# EAGLE design proto (EAGLE 6.4)
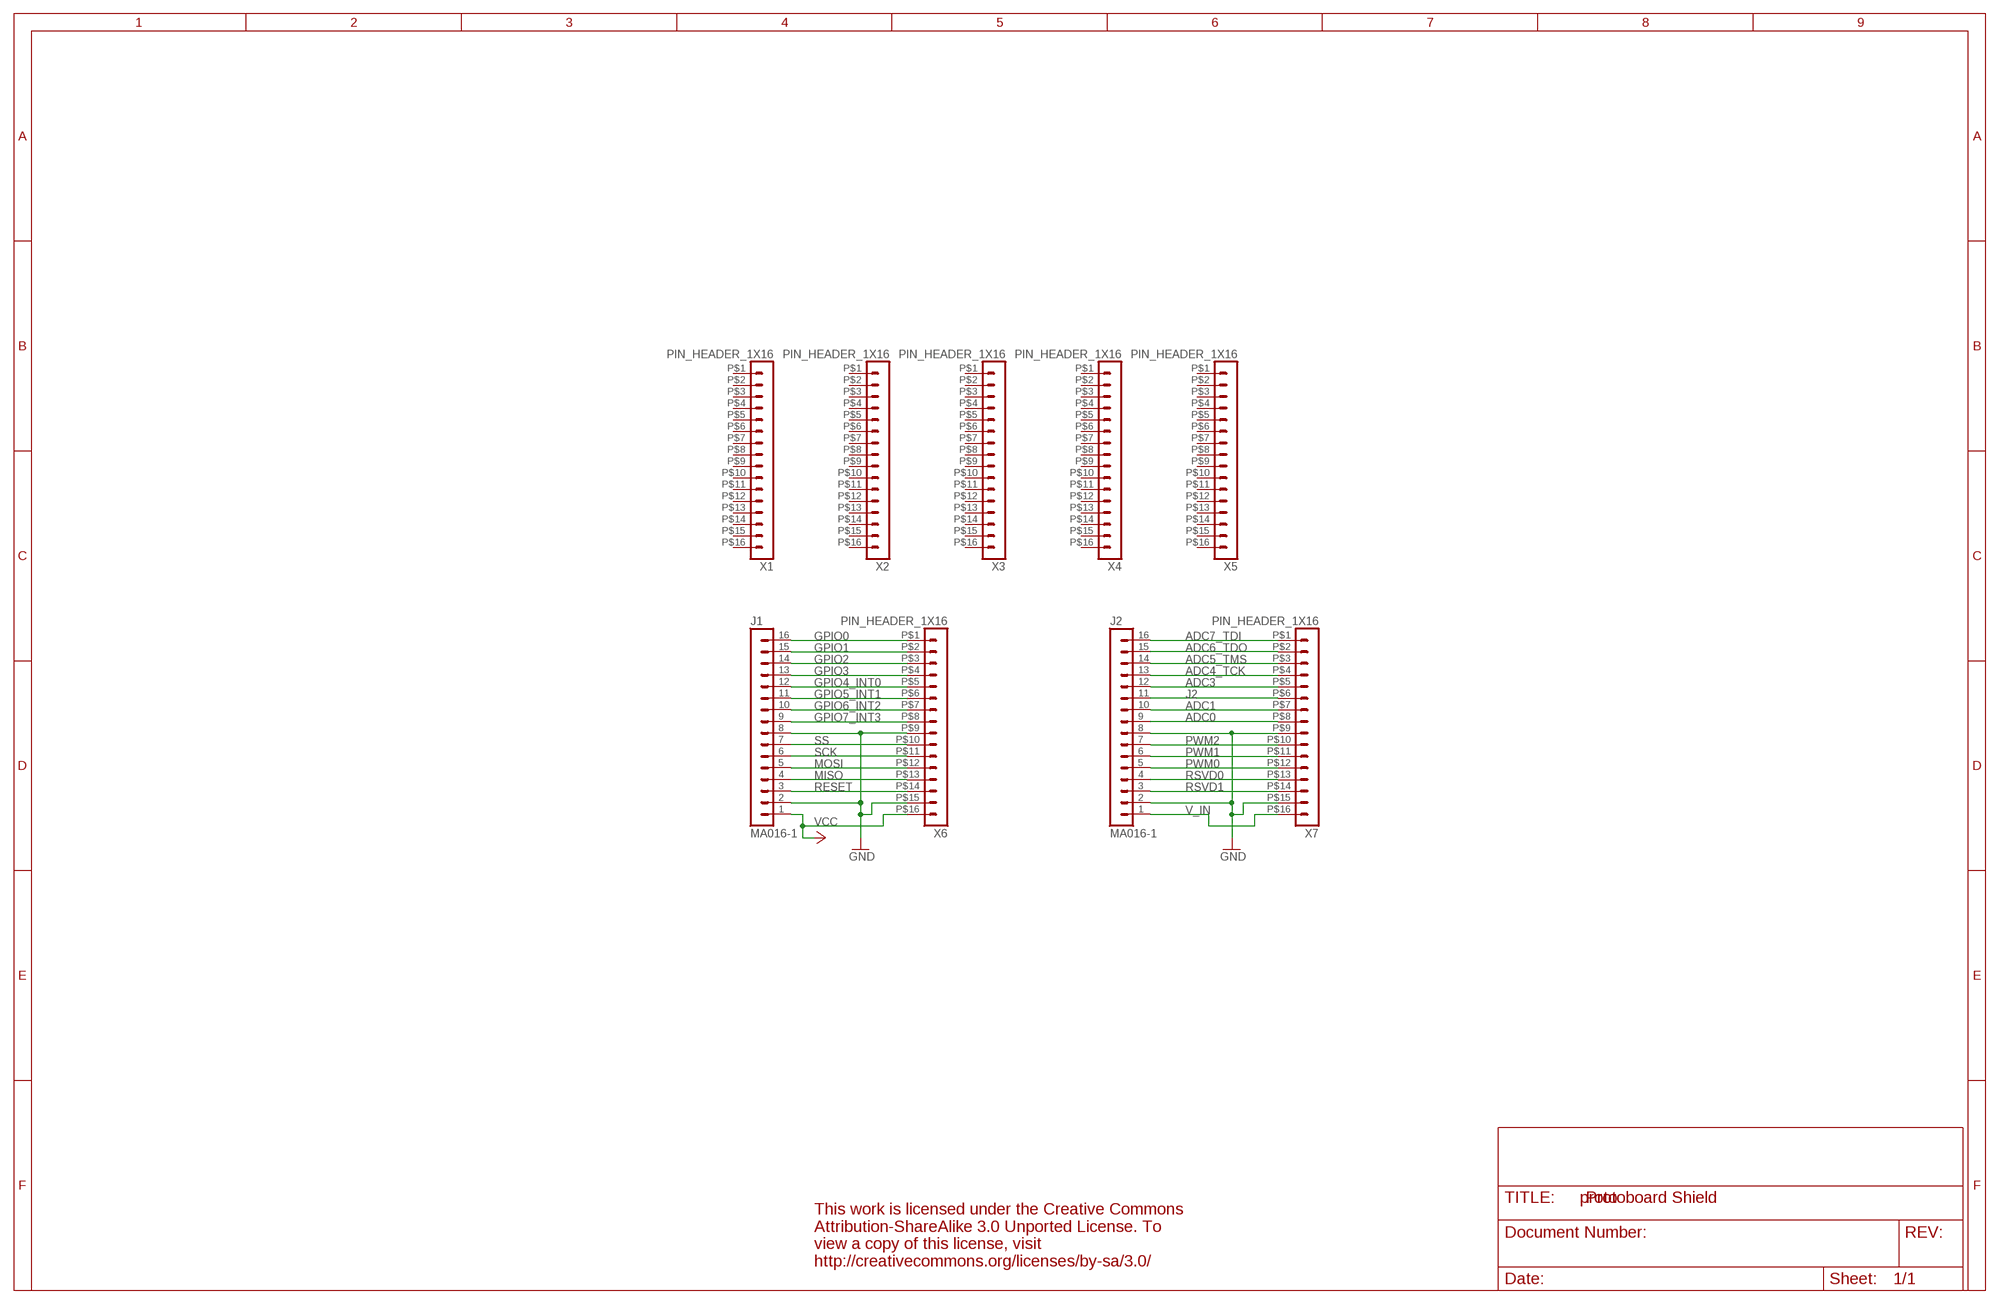
[diagram p0: schematic, sheet 1]

## Parts
J1  MA016-1  [MA016-1]
J2  MA016-1  [MA016-1]
X1  PIN_HEADER_1X16  [PIN_HEADER_1X16]
X2  PIN_HEADER_1X16  [PIN_HEADER_1X16]
X3  PIN_HEADER_1X16  [PIN_HEADER_1X16]
X4  PIN_HEADER_1X16  [PIN_HEADER_1X16]
X5  PIN_HEADER_1X16  [PIN_HEADER_1X16]
X6  PIN_HEADER_1X16  [PIN_HEADER_1X16]
X7  PIN_HEADER_1X16  [PIN_HEADER_1X16]

## Nets
ADC0: J2.9 X7.P$8
ADC1: J2.10 X7.P$7
ADC3: J2.12 X7.P$5
ADC4_TCK: J2.13 X7.P$4
ADC5_TMS: J2.14 X7.P$3
ADC6_TDO: J2.15 X7.P$2
ADC7_TDI: J2.16 X7.P$1
GND: J1.2 J1.8 J2.2 J2.8 X6.P$9 X6.P$15 X7.P$9 X7.P$15
GPIO0: J1.16 X6.P$1
GPIO1: J1.15 X6.P$2
GPIO2: J1.14 X6.P$3
GPIO3: J1.13 X6.P$4
GPIO4_INT0: J1.12 X6.P$5
GPIO5_INT1: J1.11 X6.P$6
GPIO6_INT2: J1.10 X6.P$7
GPIO7_INT3: J1.9 X6.P$8
J2: J2.11 X7.P$6
MISO: J1.4 X6.P$13
MOSI: J1.5 X6.P$12
PWM0: J2.5 X7.P$12
PWM1: J2.6 X7.P$11
PWM2: J2.7 X7.P$10
RESET: J1.3 X6.P$14
RSVD0: J2.4 X7.P$13
RSVD1: J2.3 X7.P$14
SCK: J1.6 X6.P$11
SS: J1.7 X6.P$10
V_IN: J2.1 X7.P$16
VCC: J1.1 X6.P$16
Unconnected: X1.P$1 X1.P$2 X1.P$3 X1.P$4 X1.P$5 X1.P$6 X1.P$7 X1.P$8 X1.P$9 X1.P$10 X1.P$11 X1.P$12 X1.P$13 X1.P$14 X1.P$15 X1.P$16 X2.P$1 X2.P$2 X2.P$3 X2.P$4 X2.P$5 X2.P$6 X2.P$7 X2.P$8 X2.P$9 X2.P$10 X2.P$11 X2.P$12 X2.P$13 X2.P$14 X2.P$15 X2.P$16 X3.P$1 X3.P$2 X3.P$3 X3.P$4 X3.P$5 X3.P$6 X3.P$7 X3.P$8 X3.P$9 X3.P$10 X3.P$11 X3.P$12 X3.P$13 X3.P$14 X3.P$15 X3.P$16 X4.P$1 X4.P$2 X4.P$3 X4.P$4 X4.P$5 X4.P$6 X4.P$7 X4.P$8 X4.P$9 X4.P$10 X4.P$11 X4.P$12 X4.P$13 X4.P$14 X4.P$15 X4.P$16 X5.P$1 X5.P$2 X5.P$3 X5.P$4 X5.P$5 X5.P$6 X5.P$7 X5.P$8 X5.P$9 X5.P$10 X5.P$11 X5.P$12 X5.P$13 X5.P$14 X5.P$15 X5.P$16

## Notes on the sheet
- Protoboard Shield

## Library data of the parts
J1 J2 = jeremy:MA016-1
X1-X7 = sapphire:PIN_HEADER_1X16

## Board
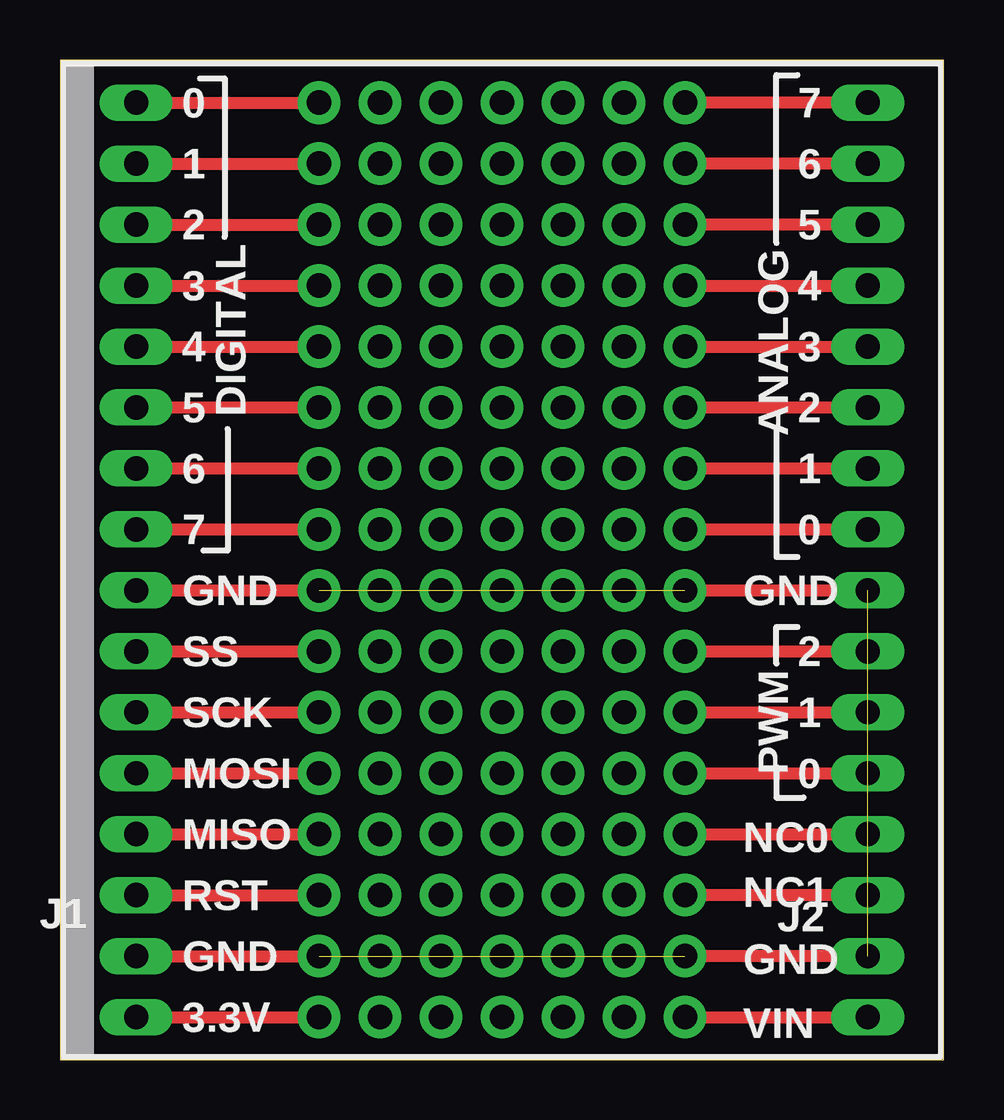
[diagram p1: board, top side]

Size 36.83 x 41.66 mm. Coordinates in mm from the lower left corner, seen from the top.
Outline: 0,0 36.83,0 36.83,41.66 0,41.66 0,0
Copper layers (1*16): Top 0.035mm / dielectric 1.5mm / Bottom 0.035mm
Design rules "default": minimum track width 10mil, minimum drill 20mil, track to track 8mil, track to pad 8mil, pad to pad 6mil, via to via 8mil, smd to smd 8mil, copper to edge 20mil, drill to drill 8mil, minimum pad ring 10mil, minimum via ring 8mil, stop-mask expansion 4mil, vias tented up to drill 0mil, thermal gap 10mil

### Footprints (pad centres in the part's own frame; a part is rotated, then mirrored left to right if it is on the bottom)
MA016-1 = drill 1.016 long: 1 -19.05,0; 2 -16.51,0; 3 -13.97,0; 4 -11.43,0; 5 -8.89,0; 6 -6.35,0; 7 -3.81,0; 8 -1.27,0; 9 1.27,0; 10 3.81,0; 11 6.35,0; 12 8.89,0; 13 11.43,0; 14 13.97,0; 15 16.51,0; 16 19.05,0
PIN_HEADER_1X16 = drill 1.016 pad 1.778: P$1 -19.05,0; P$2 -16.51,0; P$3 -13.97,0; P$4 -11.43,0; P$5 -8.89,0; P$6 -6.35,0; P$7 -3.81,0; P$8 -1.27,0; P$9 1.27,0; P$10 3.81,0; P$11 6.35,0; P$12 8.89,0; P$13 11.43,0; P$14 13.97,0; P$15 16.51,0; P$16 19.05,0

### Placement (x,y rotation side)
J1  3.17,20.83 90 top
J2  33.66,20.83 90 top
X1  13.34,20.83 90 top
X2  15.88,20.83 90 top
X3  18.41,20.83 90 top
X4  20.96,20.83 90 top
X5  23.5,20.83 90 top
X6  10.79,20.83 270 top
X7  26.04,20.83 270 top

### Tracks (layer width: path | path; a pad name or v marks a point on that pad's centre or on a via)
ADC0
  Top 0.508: X7.P$8 J2.9
ADC1
  Top 0.508: X7.P$7 J2.10
ADC3
  Top 0.508: X7.P$5 J2.12
ADC4_TCK
  Top 0.508: X7.P$4 J2.13
ADC5_TMS
  Top 0.508: J2.14 X7.P$3
ADC6_TDO
  Top 0.508: J2.15 X7.P$2
ADC7_TDI
  Top 0.508: J2.16 X7.P$1
GND  (3 unrouted)
  Top 0.508: J1.8 X6.P$9 | J1.2 X6.P$15 | X7.P$9 J2.8 | J2.2 X7.P$15
GPIO0
  Top 0.508: J1.16 X6.P$1
GPIO1
  Top 0.508: J1.15 X6.P$2
GPIO2
  Top 0.508: J1.14 X6.P$3
GPIO3
  Top 0.508: J1.13 X6.P$4
GPIO4_INT0
  Top 0.508: J1.12 X6.P$5
GPIO5_INT1
  Top 0.508: J1.11 X6.P$6
GPIO6_INT2
  Top 0.508: J1.10 X6.P$7
GPIO7_INT3
  Top 0.508: J1.9 X6.P$8
J2
  Top 0.508: X7.P$6 J2.11
MISO
  Top 0.508: J1.4 X6.P$13
MOSI
  Top 0.508: J1.5 X6.P$12
PWM0
  Top 0.508: X7.P$12 J2.5
PWM1
  Top 0.508: X7.P$11 J2.6
PWM2
  Top 0.508: X7.P$10 J2.7
RESET
  Top 0.508: J1.3 X6.P$14
RSVD0
  Top 0.508: X7.P$13 J2.4
RSVD1
  Top 0.508: J2.3 X7.P$14
SCK
  Top 0.508: J1.6 X6.P$11
SS
  Top 0.508: J1.7 X6.P$10
V_IN
  Top 0.508: X7.P$16 J2.1
VCC
  Top 0.508: J1.1 X6.P$16

### Text on the board
tSilk: 0 | 7 | 1 | 6 | 2 | ANALOG | 5 | 3 | 4 | 4 | 3 | 5 | DIGITAL | 2 | 6 | 1 | 7 | 0 | GND | GND | SS | 2 | PWM | SCK | 1 | MOSI | 0 | MISO | NC0 | NC1 | RST | GND | GND | 3.3V | VIN